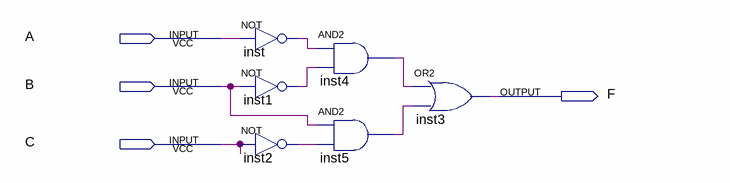
[diagram p0: schematic sheet]
// Quartus schematic main.bdf as structural Verilog: 6 symbols, 4 pins
module main (
  input  A,
  input  B,
  input  C,
  output F
);

  wire inst1_out, inst2_out, inst4_out, inst5_out, inst_out;

  not inst (inst_out, A);
  not inst1 (inst1_out, B);
  not inst2 (inst2_out, C);
  and inst4 (inst4_out, inst_out, inst1_out);
  and inst5 (inst5_out, B, inst2_out);
  or inst3 (F, inst4_out, inst5_out);
endmodule
